# Altium schematic sheet BiGaN.SchDoc
size A3; SheetNumber: 4; SheetTotal: 7
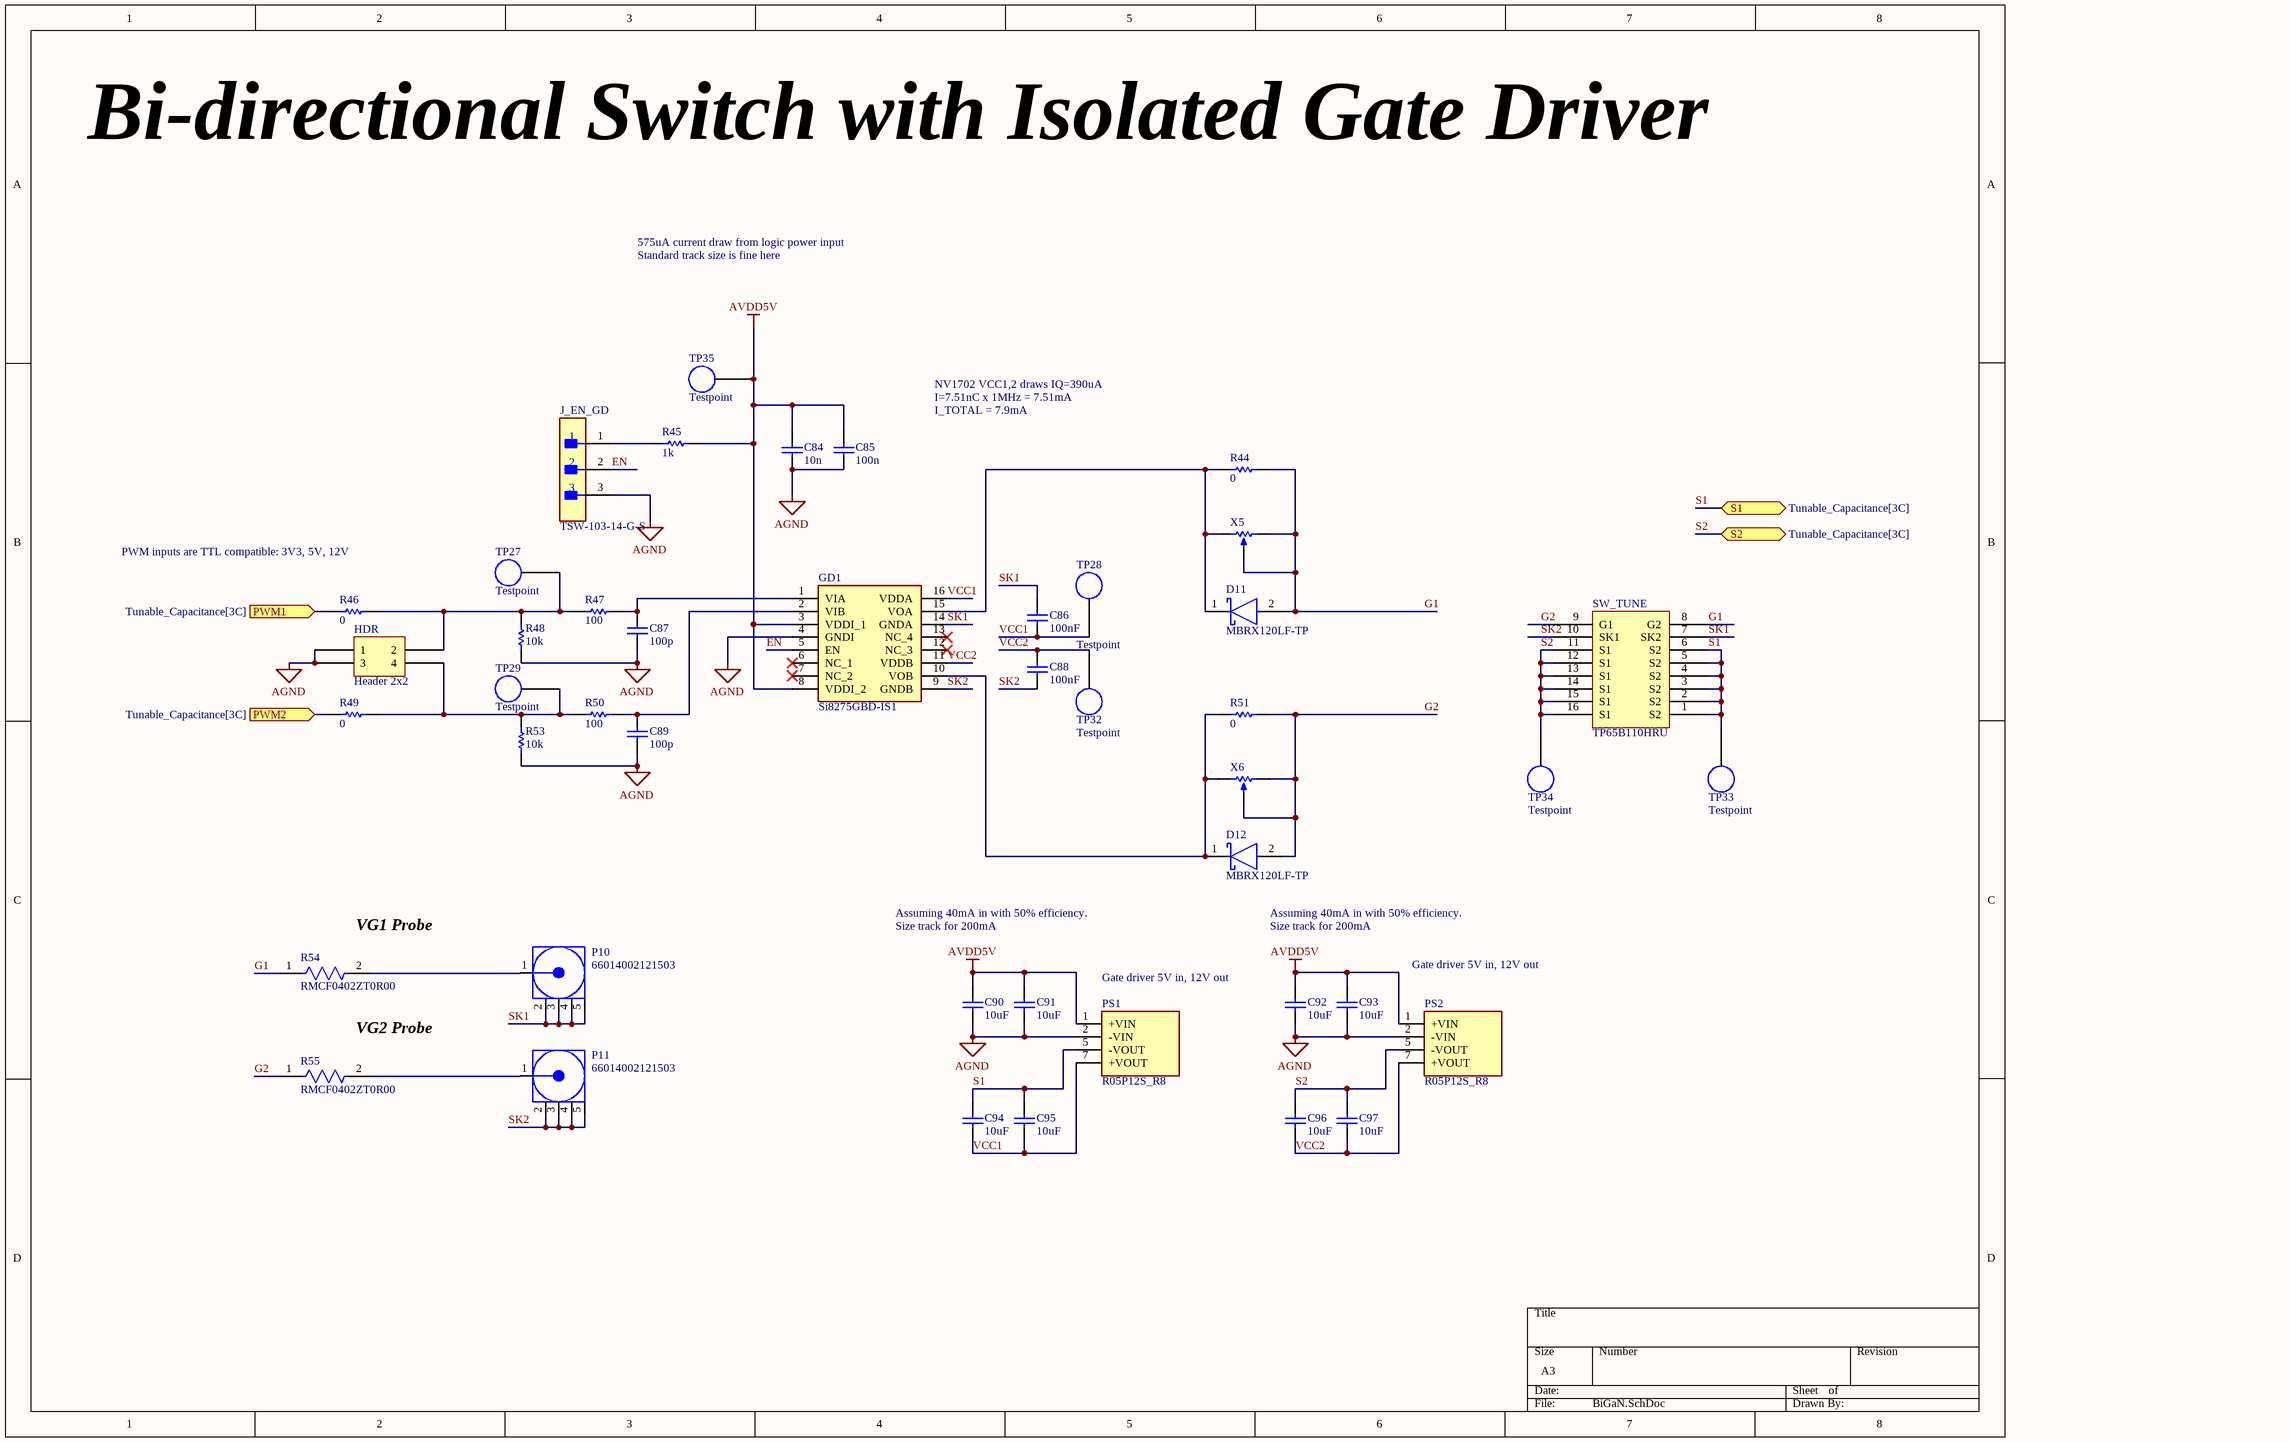
[diagram p0: BiGaN.SchDoc]

## Parts
C84  value 10n  [C0603]  (hidden comment: C0603C103K5RACTU)
C85  value 100n  [CAPC1608X95N]  (hidden comment: C0603C104K5RACTU7042)
C86  value 100nF  [CAPC1608X90N]  (hidden comment: 0.1μF)
C87  value 100p  [CAPC1608X90N]  (hidden comment: CL10C101JB8NNNC)
C88  value 100nF  [CAPC1608X90N]  (hidden comment: 0.1μF)
C89  value 100p  [CAPC1608X90N]  (hidden comment: CL10C101JB8NNNC)
C90  value 10uF  [CAPC2012X14N]  (hidden comment: 10μF)
C91  value 10uF  [CAPC2012X14N]  (hidden comment: 10μF)
C92  value 10uF  [CAPC2012X14N]  (hidden comment: 10μF)
C93  value 10uF  [CAPC2012X14N]  (hidden comment: 10μF)
C94  value 10uF  [CAPC2012X14N]  (hidden comment: 10μF)
C95  value 10uF  [CAPC2012X14N]  (hidden comment: 10μF)
C96  value 10uF  [CAPC2012X14N]  (hidden comment: 10μF)
C97  value 10uF  [CAPC2012X14N]  (hidden comment: 10μF)
D11  MBRX120LF-TP  [FP-SOD-123-IPC_A]
D12  MBRX120LF-TP  [FP-SOD-123-IPC_A]
GD1  Si8275GBD-IS1  [SOIC127P600X175-16N]
HDR  Header 2x2  [HEADER 2x2]
J_EN_GD  TSW-103-14-G-S  [FP-TSW-103-14-G-S-MFG]
P10  66014002121503  [66014002121503]
P11  66014002121503  [66014002121503]
PS1  R05P12S_R8  [R05P12SR8]
PS2  R05P12S_R8  [R05P12SR8]
R44  value 0  [RESC1608X55N]  (hidden comment: RC0603FR-070RL)
R45  value 1k  [RESC1608X55N]  (hidden comment: RC0603FR-071KL)
R46  value 0  [RESC1608X55N]  (hidden comment: RC0603FR-070RL)
R47  value 100  [RESC1608X55N]  (hidden comment: RC0603FR-07100RL)
R48  value 10k  [RESC1608X55N]  (hidden comment: RC0603FR0710KL)
R49  value 0  [RESC1608X55N]  (hidden comment: RC0603FR-070RL)
R50  value 100  [RESC1608X55N]  (hidden comment: RC0603FR-07100RL)
R51  value 0  [RESC1608X55N]  (hidden comment: RC0603FR-070RL)
R53  value 10k  [RESC1608X55N]  (hidden comment: RC0603FR0710KL)
R54  RMCF0402ZT0R00  [FP-RMCF0402-MFG]
R55  RMCF0402ZT0R00  [FP-RMCF0402-MFG]
SW_TUNE  TP65B110HRU  [NV6428]
TP27  Testpoint  [TP_5006]
TP28  Testpoint  [TP_5006]
TP29  Testpoint  [TP_5006]
TP32  Testpoint  [TP_5006]
TP33  Testpoint  [TP_5006]
TP34  Testpoint  [TP_5006]
TP35  Testpoint  [TP_5006]
X5  3296W-1-200LF  [3296W1200LF]  (value not drawn)
X6  3296W-1-200LF  [3296W1200LF]  (value not drawn)

## Ports
PWM1 (in, see Tunable_Capacitance[3C]), PWM2 (in, see Tunable_Capacitance[3C]), S1 (bidir, see Tunable_Capacitance[3C]), S2 (bidir, see Tunable_Capacitance[3C])

## Nets
AGND: C84.1 C85.1 C87.1 C89.1 C90.1 C91.1 C92.1 C93.1 GD1.4(GNDI) HDR.1 HDR.3 J_EN_GD.3 PS1.2(-VIN) PS2.2(-VIN) R48.1 R53.1
AVDD5V: C84.2 C85.2 C90.2 C91.2 C92.2 C93.2 GD1.3(VDDI_1) GD1.8(VDDI_2) PS1.1(+VIN) PS2.1(+VIN) R45.2 TP35.1
EN: GD1.5(EN) J_EN_GD.2
G1: D11.2(A) R44.2 R54.1 SW_TUNE.8(G2) X5.2(BOT) X5.3(TAP)
G2: D12.2(A) R51.2 R55.1 SW_TUNE.9(G1) X6.2(BOT) X6.3(TAP)
PWM1: R46.1 ; port PWM1
PWM2: R49.1 ; port PWM2
S1: C94.1 C95.1 PS1.5(-VOUT) SW_TUNE.1(S2) SW_TUNE.2(S2) SW_TUNE.3(S2) SW_TUNE.4(S2) SW_TUNE.5(S2) SW_TUNE.6(S2) TP33.1 ; port S1
S2: C96.1 C97.1 PS2.5(-VOUT) SW_TUNE.11(S1) SW_TUNE.12(S1) SW_TUNE.13(S1) SW_TUNE.14(S1) SW_TUNE.15(S1) SW_TUNE.16(S1) TP34.1 ; port S2
SK1: C86.1 GD1.14(GNDA) P10.2(GND) P10.3(GND) P10.4(GND) P10.5(GND) SW_TUNE.7(SK2)
SK2: C88.2 GD1.9(GNDB) P11.2(GND) P11.3(GND) P11.4(GND) P11.5(GND) SW_TUNE.10(SK1)
VCC1: C86.2 C94.2 C95.2 GD1.16(VDDA) PS1.7(+VOUT) TP28.1
VCC2: C88.1 C96.2 C97.2 GD1.11(VDDB) PS2.7(+VOUT) TP32.1
NetC87_2: C87.2 GD1.1(VIA) R47.2
NetC89_2: C89.2 GD1.2(VIB) R50.2
NetD11_1: D11.1(C) GD1.15(VOA) R44.1 X5.1(TOP)
NetD12_1: D12.1(C) GD1.10(VOB) R51.1 X6.1(TOP)
NetHDR_2: HDR.2 R46.2 R47.1 R48.2 TP27.1
NetHDR_4: HDR.4 R49.2 R50.1 R53.2 TP29.1
NetJ_EN_GD_1: J_EN_GD.1 R45.1
NetP10_1: P10.1(Signal) R54.2
NetP11_1: P11.1(Signal) R55.2

Not connected (* = marked no-connect by the designer): GD1 6(NC_1)* 7(NC_2)* 12(NC_3)* 13(NC_4)*

## Notes on the sheet
- Bi-directional Switch with Isolated Gate Driver
- 575uA current draw from logic power input
- Standard track size is fine here
- NV1702 VCC1,2 draws IQ=390uA
- I=7.51nC x 1MHz = 7.51mA
- I_TOTAL = 7.9mA
- PWM inputs are TTL compatible: 3V3, 5V, 12V
- (near R54) VG1 Probe
- Assuming 40mA in with 50% efficiency.
- Size track for 200mA
- Gate driver 5V in, 12V out
- VG2 Probe

## Library data of the parts
C84 = C0603C103K5RACTU: Capacitor, 10000 pF ±10% 50V Ceramic Capacitor X7R 0603 (1608 Metric); Manufacturer_Name: YAGEO; Datasheet Link: https://content.kemet.com/datasheets/KEM_C1002_X7R_SMD.pdf; Height: 0.87mm; Manufacturer_Part_Number: C0603C103K5RACTU; Mouser Part Number: 80-C0603C103K5R; Mouser Price/Stock: https://www.mouser.co.uk/ProductDetail/KEMET/C0603C103K5RACTU?qs=aZBT8IJKz4hu1X55tMAU6Q%3D%3D; Arrow Part Number: C0603C103K5RACTU; Arrow Price/Stock: https://www.arrow.com/en/products/c0603c103k5ractu/kemet-corporation?utm_currency=USD&region=nac
C85 = C0603C104K5RACTU7042: Capacitor, 0.1 µF ±10% 50V Ceramic Capacitor X7R 0603 (1608 Metric); Manufacturer_Name: YAGEO; Height: 0.95mm; Datasheet Link: https://www.arrow.com/en/products/c0603c104k5ractu7042/kemet-corporation; Manufacturer_Part_Number: C0603C104K5RACTU7042; Arrow Part Number: C0603C104K5RACTU7042; Arrow Price/Stock: https://www.arrow.com/en/products/c0603c104k5ractu7042/kemet-corporation
C86 C88 = CC0603KRX7R7BB104: Ceramic Capacitor, Multilayer, Ceramic, 16V, 10% +Tol, 10% -Tol, X7R, 15% TC, 0.1uF, Surface Mount, 0603 https://www.digikey.ie/en/products/detail/yageo/CC0603KRX7R7BB104/302822; Manufacturer: Yageo; Multilayer: Yes; Supplier: Digikey; Supplier Part Number: 311-1088-1-ND; Manufacturer Part Number: CC0603KRX7R7BB104; RoHS: Yes; Category: Ceramic Capacitors; Stock: 8597331; Mounting Technology: Surface Mount; Pins: 2; Dielectric Material: Ceramic; Package Shape: Rectangular; Case/Package: 0603; Terminal Finish: Nickel; Min Operating Temperature: -55°C; Max Operating Temperature: 125°C; JESD-609 Code: e3; Capacitor Type: Ceramic; Tolerance  (fill in as +-): 10%; Package Style: SMTMeter; Packaging: Tape and Reel; Tolerance (fill in as +-): 10%; Rated DC Voltage (URdc): 16V; Temperature Characteristics Code: X7R; Termination: Wraparound; Length: 1.6mm; Width: 0.8mm; Height: 0.8mm; Reach SVHC Compliant: Yes; RoHS Compliant: Yes; ComponentLink1URL: https://datasheet.ciiva.com:443/pdfs/VipMasterIC/IC/YAGO/YAGO-S-A0003557223/YAGO-S-A0003557223-1.pdf?src-supplier=IHS+Markit; ComponentLink1Description: https://datasheet.ciiva.com:443/pdfs/VipMasterIC/IC/YAGO/YAGO-S-A0003557223/YAGO-S-A0003557223-1.pdf?src-supplier=IHS+Markit; ComponentLink2URL: https://datasheet.ciiva.com/11786/0900766b80d84f1d-11786077.pdf?src-supplier=Rs; ComponentLink2Description: https://datasheet.ciiva.com/11786/0900766b80d84f1d-11786077.pdf?src-supplier=Rs; ComponentLink3URL: https://datasheet.ciiva.com/8033/70765-8033799.pdf?src-supplier=Element14; ComponentLink3Description: https://datasheet.ciiva.com/8033/70765-8033799.pdf?src-supplier=Element14; ComponentLink4URL: https://datasheet.ciiva.com/7978/1489800-7978141.pdf?src-supplier=Element14; ComponentLink4Description: https://datasheet.ciiva.com/7978/1489800-7978141.pdf?src-supplier=Element14; ComponentLink5URL: https://datasheet.ciiva.com/28450/1489800-28450552.pdf?src-supplier=Element14; ComponentLink5Description: https://datasheet.ciiva.com/28450/1489800-28450552.pdf?src-supplier=Element14; ComponentLink6URL: https://datasheet.ciiva.com/46430/1734573-46430156.pdf?src-supplier=Element14; ComponentLink6Description: https://datasheet.ciiva.com/46430/1734573-46430156.pdf?src-supplier=Element14; ComponentLink7URL: https://datasheet.ciiva.com/144/mlccorderingcode-144183.pdf?src-supplier=Digikey; ComponentLink7Description: https://datasheet.ciiva.com/144/mlccorderingcode-144183.pdf?src-supplier=Digikey; ComponentLink8URL: https://datasheet.ciiva.com/144/mlccorderingcode-144182.pdf?src-supplier=Digikey; ComponentLink8Description: https://datasheet.ciiva.com/144/mlccorderingcode-144182.pdf?src-supplier=Digikey; ComponentLink9URL: https://datasheet.ciiva.com/144/mlccorderingcode-144184.pdf?src-supplier=Digikey; ComponentLink9Description: https://datasheet.ciiva.com/144/mlccorderingcode-144184.pdf?src-supplier=Digikey; ComponentLink10URL: https://datasheet.ciiva.com/8033/1734573-8033797.pdf?src-supplier=Element14; ComponentLink10Description: https://datasheet.ciiva.com/8033/1734573-8033797.pdf?src-supplier=Element14; ComponentLink11URL: https://datasheet.ciiva.com/13395/upy-gphc-x7r-6-3v-to-50v-8-13395674.pdf?src-supplier=Mouser; ComponentLink11Description: https://datasheet.ciiva.com/13395/upy-gphc-x7r-6-3v-to-50v-8-13395674.pdf?src-supplier=Mouser
C87 C89 = CL10C101JB8NNNC: Capacitor, 100 pF ±5% 50V Ceramic Capacitor C0G, NP0 0603 (1608 Metric); Manufacturer_Name: SAMSUNG; Datasheet Link: https://lcsc.componentsearchengine.com/Datasheets/2/CL10C101JB8NNNC.pdf; Height: 0.9mm; Manufacturer_Part_Number: CL10C101JB8NNNC; Mouser Part Number: 187-CL10C101JB8NNNC; Mouser Price/Stock: https://www.mouser.co.uk/ProductDetail/Samsung-Electro-Mechanics/CL10C101JB8NNNC?qs=349EhDEZ59pXXooLigsK%2FQ%3D%3D; Arrow Part Number: CL10C101JB8NNNC; Arrow Price/Stock: https://www.arrow.com/en/products/cl10c101jb8nnnc/samsung-electro-mechanics?region=europe
C90-C97 = GRM21BZ71E106KE15L: Multilayer Ceramic Capacitor, 10 uF, 25 V, ï¿½ 10%, X7R, 0805 [2012 Metric] https://www.digikey.ie/en/products/detail/murata-electronics/GRM21BZ71E106KE15L/13904911; Manufacturer: Murata; Material: 4241ConductorMaterial; Voltage Rating: 25V; Supplier: Future Electronics; Supplier Part Number: 6134628; Manufacturer Part Number: GRM21BZ71E106KE15L; Category: Ceramic Capacitors; Stock: 81000; Case/Package: 339Case; Min Operating Temperature: -55°C; Max Operating Temperature: 125°C; Tolerance: 10%; Length: 2mm; Width: 1.25mm; Height: 1.45mm; Thickness: 1.25mm; RoHS Compliant: Yes; ComponentLink1URL: https://datasheet.octopart.com/GRM21BZ71E106KE15L-Murata-datasheet-141278873.pdf?src-supplier=Geoflip; ComponentLink1Description: https://datasheet.octopart.com/GRM21BZ71E106KE15L-Murata-datasheet-141278873.pdf?src-supplier=Geoflip; ComponentLink2URL: https://datasheet.octopart.com/GRM21BZ71E106KE15L-Murata-datasheet-165579666.pdf?src-supplier=TME; ComponentLink2Description: https://datasheet.octopart.com/GRM21BZ71E106KE15L-Murata-datasheet-165579666.pdf?src-supplier=TME; ComponentLink3URL: https://datasheet.octopart.com/GRM21BZ71E106KE15L-Murata-datasheet-140707837.pdf?src-supplier=Ciiva+Crawler; ComponentLink3Description: https://datasheet.octopart.com/GRM21BZ71E106KE15L-Murata-datasheet-140707837.pdf?src-supplier=Ciiva+Crawler; ComponentLink4URL: https://datasheet.octopart.com/GRM21BZ71E106KE15L-Murata-datasheet-138745134.pdf?src-supplier=Ciiva+Crawler; ComponentLink4Description: https://datasheet.octopart.com/GRM21BZ71E106KE15L-Murata-datasheet-138745134.pdf?src-supplier=Ciiva+Crawler
D11 D12 = CMP-56206-000012-1: DIODE SCHOTTKY 20V 1A SOD123; Max Power Dissipation: 556mW; Forward Voltage: 360mV; Peak Non-Repetitive Surge Current: 12A; Element Configuration: Single; Max Reverse Voltage (DC): 20V; Lead Free: Lead Free; Max Operating Temperature: 125°C; Radiation Hardening: No; Mount: Surface Mount; Number of Pins: 2; Average Rectified Current: 1A; Min Operating Temperature: -65°C; Max Repetitive Reverse Voltage (Vrrm): 20V; RoHS Compliant: Yes; Package Quantity: 1; Max Forward Surge Current (Ifsm): 12A; Packaging: Tape and Reel; Max Surge Current: 12A; Forward Current: 1A
GD1 = Si8275GBD-IS1: Integrated Circuit; Manufacturer_Name: Silicon Labs; Datasheet Link: https://www.silabs.com/documents/public/data-sheets/Si827x.pdf; Height: 1.75mm; Manufacturer_Part_Number: Si8275GBD-IS1; Mouser Part Number: 634-SI8275GBD-IS1; Mouser Price/Stock: https://www.mouser.co.uk/ProductDetail/Silicon-Labs/SI8275GBD-IS1?qs=j6MGy4L9yX2SPc9HOZMvjA%3D%3D; Arrow Part Number: SI8275GBD-IS1; Arrow Price/Stock: https://www.arrow.com/en/products/si8275gbd-is1/silicon-labs
HDR = Header 2x2: Connector Header Through Hole 4 position 0.100" (2.54mm), PH2-04-UA
J_EN_GD = CMP-02766-001743-1: CONN HEADER VERT 3POS 2.54MM; Max Voltage Rating (AC): 550V; Number of Positions: 3; Max Current Rating: 7.6A; Gender: Male; Termination: Solder; RoHS Compliant: Yes; Mount: Through Hole; Lead Free: Lead Free; Connector Type: Header; REACH SVHC: No SVHC; Insulation Color: Black; Width: 2.54mm; Length: 7.62mm; Flammability Rating: UL94 V-0; Housing Material: Polyester; Contact Material: Bronze; Max Operating Temperature: 125°C; Fastening Type: Pull; Series: TSW; Number of Contacts: 3; Packaging: Bulk; Min Operating Temperature: -55°C; Package Quantity: 1; Height: 10.67mm; Pitch: 2.54mm; Contact Finish - Mating: GOLD; Contact Type: Male Pin; Radiation Hardening: No; Color: Black; Housing Color: Black; Contact Plating: Gold; Orientation: Straight; Number of Rows: 1; Depth: 2.54mm; Insulation Material: PBT; Contact Mating Length: 0.32inch; Contact Shape: Square
P10 P11 = CMP-03913-103108763-2: Connector, Tht Mount, Straight, 0.7 Cbl Dia., 50 Ohms, Wr-mmcx; Insertion Loss (dB): 0.25dB; Insulation Resistance: 1GΩ; Connector Type: MMCX; Impedance: 50Ω; Min Operating Temperature: -55°C; Max Operating Temperature: 155°C; Insulation Material: PTFE
PS1 PS2 = R05P12S_R8: Power Supply; Manufacturer_Name: RECOM Power; Manufacturer_Part_Number: R05P12S/R8; Datasheet Link: https://www.mouser.de/datasheet/2/468/RxxPxx_R-1710046.pdf; Height: 13mm; Mouser Part Number: 919-R05P12SR8; Mouser Price/Stock: https://www.mouser.co.uk/ProductDetail/RECOM-Power/R05P12S-R8?qs=%252BHKxvJ84kqo5EQ%2FKTjgTzw%3D%3D
R44 R46 R49 R51 = RC0603FR-070RL: Resistor, 0 Ohms Jumper 0.1W, 1/10W Chip Resistor 0603 (1608 Metric) Moisture Resistant Thick Film; Manufacturer_Name: YAGEO; Datasheet Link: http://www.yageo.com/documents/recent/PYu-RC0603_51_RoHS_L_v5.pdf; Height: 0.55mm; Manufacturer_Part_Number: RC0603FR-070RL; Mouser Part Number: 603-RC0603FR-070RL; Mouser Price/Stock: https://www.mouser.co.uk/ProductDetail/YAGEO/RC0603FR-070RL?qs=0yPvnVz5%2FmpDQv43TwvCfw%3D%3D; Arrow Part Number: RC0603FR-070RL; Arrow Price/Stock: https://www.arrow.com/en/products/rc0603fr-070rl/yageo?region=nac
R45 = RC0603FR-071KL: Resistor, 1 kOhms ±1% 0.1W, 1/10W Chip Resistor 0603 (1608 Metric) Moisture Resistant Thick Film; Manufacturer_Name: YAGEO; Datasheet Link: https://www.yageo.com/upload/media/product/productsearch/datasheet/rchip/PYu-RC_Group_51_RoHS_L_12.pdf; Height: 0.55mm; Manufacturer_Part_Number: RC0603FR-071KL; Mouser Part Number: 603-RC0603FR-071KL; Mouser Price/Stock: https://www.mouser.co.uk/ProductDetail/YAGEO/RC0603FR-071KL?qs=VU8sRB4EgwApHsk4rF%2F3zg%3D%3D; Arrow Part Number: RC0603FR-071KL; Arrow Price/Stock: https://www.arrow.com/en/products/rc0603fr-071kl/yageo?utm_currency=USD&region=nac
R47 R50 = RC0603FR-07100RL: Resistor, 100 Ohms ±1% 0.1W, 1/10W Chip Resistor 0603 (1608 Metric) Moisture Resistant Thick Film; Manufacturer_Name: YAGEO; Datasheet Link: http://www.yageo.com/documents/recent/PYu-RC0603_51_RoHS_L_v5.pdf; Height: 0.55mm; Manufacturer_Part_Number: RC0603FR-07100RL; Mouser Part Number: 603-RC0603FR-07100RL; Mouser Price/Stock: https://www.mouser.co.uk/ProductDetail/YAGEO/RC0603FR-07100RL?qs=NEN%2FsE%2FLsvPIwIWKCOS4%2FA%3D%3D; Arrow Part Number: RC0603FR-07100RL; Arrow Price/Stock: https://www.arrow.com/en/products/rc0603fr-07100rl/yageo?region=europe
R48 R53 = RC0603FR0710KL: Resistor, 10 kOhms ±1% 0.1W, 1/10W Chip Resistor 0603 (1608 Metric) Moisture Resistant Thick Film; Manufacturer_Name: YAGEO; Datasheet Link: http://www.yageo.com/documents/recent/PYu-RC0603_51_RoHS_L_v5.pdf; Height: 0.55mm; Manufacturer_Part_Number: RC0603FR0710KL; Arrow Part Number: RC0603FR0710KL; Arrow Price/Stock: https://www.arrow.com/en/products/rc0603fr-0710kl/yageo
R54 R55 = CMP-26527-007617-1: RES 0 OHM JUMPER 1/16W 0402; Power Rating: 63mW; Working Voltage: 50V; Current Rating: 1A; Resistance: 0R; Series: RMCF; RoHS Compliant: Yes; Features: Automotive AEC-Q200; Width: 0.02inch; Depth: 0.5mm; Resistor Type: Thick Film; Number of Terminations: 2; Radiation Hardening: No; Length: 0.039inch; Contact Plating: Tin; Case/Package: 0402; Min Operating Temperature: -55°C; Case Code (Metric): 1005; Construction: Rectangular; Mount: Surface Mount; Max Operating Temperature: 155°C; Max Power Dissipation: 63mW; Height: 0.016inch; Lead Free: Lead Free; Packaging: Tape and Reel; Technology: THICK FILM; Case Code (Imperial): 0402; Military Standard: Not
SW_TUNE = TP65B110HRU: Renesas bidirection GaN switch / https://www.renesas.com/en/document/dst/tp65b110hru-datasheet?r=25610905
X5 X6 = 3296W-1-200LF: Variable Resistor; Manufacturer_Name: Bourns; Datasheet Link: https://componentsearchengine.com/Datasheets/2/3296W-1-200LF.pdf; Height: 10.28mm; Manufacturer_Part_Number: 3296W-1-200LF; Mouser Part Number: 652-3296W-1-200LF; Mouser Price/Stock: https://www.mouser.co.uk/ProductDetail/Bourns/3296W-1-200LF?qs=R4%2FAj8xQbdUOcUUWJIVY1Q%3D%3D; Arrow Part Number: 3296W-1-200LF; Arrow Price/Stock: https://www.arrow.com/en/products/3296w-1-200lf/bourns?utm_currency=USD&region=nac